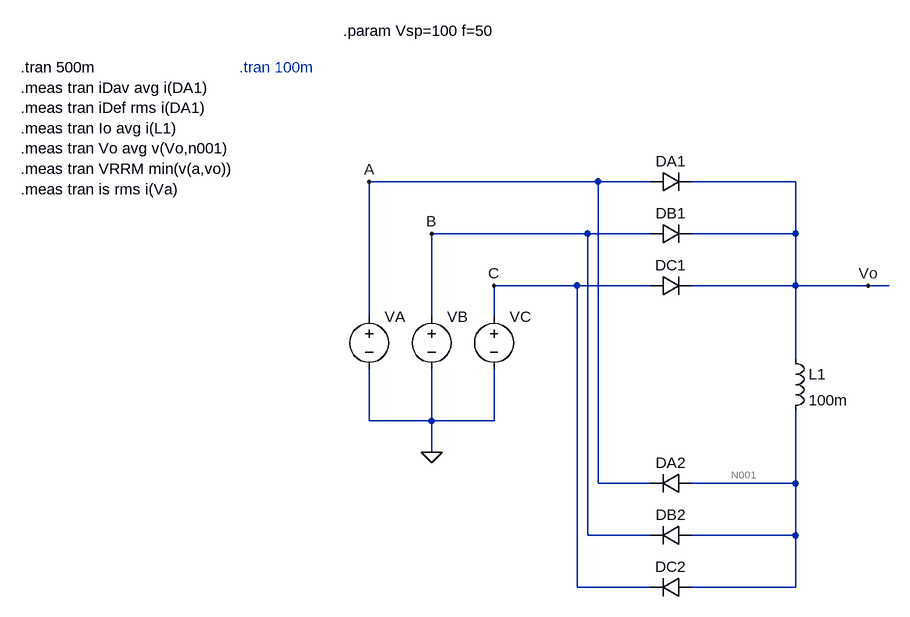
[diagram p0: schematic rectificPolif.asc]
rectificPolif.asc, the LTspice schematic file:
Version 4
SHEET 1 1716 984
WIRE 1072 224 720 224
WIRE 1152 224 1072 224
WIRE 1376 224 1216 224
WIRE 1056 304 816 304
WIRE 1152 304 1056 304
WIRE 1376 304 1376 224
WIRE 1376 304 1216 304
WIRE 1040 384 912 384
WIRE 1152 384 1040 384
WIRE 1376 384 1376 304
WIRE 1376 384 1216 384
WIRE 1488 384 1376 384
WIRE 1520 384 1488 384
WIRE 720 432 720 224
WIRE 816 432 816 304
WIRE 912 432 912 384
WIRE 1376 496 1376 384
WIRE 720 592 720 512
WIRE 816 592 816 512
WIRE 816 592 720 592
WIRE 912 592 912 512
WIRE 912 592 816 592
WIRE 816 640 816 592
WIRE 1072 688 1072 224
WIRE 1152 688 1072 688
WIRE 1376 688 1376 576
WIRE 1376 688 1216 688
WIRE 1056 768 1056 304
WIRE 1152 768 1056 768
WIRE 1376 768 1376 688
WIRE 1376 768 1216 768
WIRE 1040 848 1040 384
WIRE 1152 848 1040 848
WIRE 1376 848 1376 768
WIRE 1376 848 1216 848
FLAG 720 224 A
FLAG 816 304 B
FLAG 912 384 C
FLAG 1488 384 Vo
FLAG 816 640 0
SYMBOL diode 1152 240 R270
WINDOW 0 32 32 VTop 2
WINDOW 3 0 32 Invisible 2
SYMATTR InstName DA1
SYMBOL diode 1216 672 R90
WINDOW 0 0 32 VBottom 2
WINDOW 3 32 32 Invisible 2
SYMATTR InstName DA2
SYMBOL diode 1152 320 R270
WINDOW 0 32 32 VTop 2
WINDOW 3 0 32 Invisible 2
SYMATTR InstName DB1
SYMBOL diode 1152 400 R270
WINDOW 0 32 32 VTop 2
WINDOW 3 0 32 Invisible 2
SYMATTR InstName DC1
SYMBOL diode 1216 752 R90
WINDOW 0 0 32 VBottom 2
WINDOW 3 32 32 Invisible 2
SYMATTR InstName DB2
SYMBOL diode 1216 832 R90
WINDOW 0 0 32 VBottom 2
WINDOW 3 32 32 Invisible 2
SYMATTR InstName DC2
SYMBOL voltage 720 416 R0
WINDOW 3 24 96 Invisible 2
WINDOW 123 0 0 Left 0
WINDOW 39 0 0 Left 0
SYMATTR Value SINE(0 {Vsp} {f} 0 0 120)
SYMATTR InstName VA
SYMBOL voltage 912 416 R0
WINDOW 3 24 96 Invisible 2
WINDOW 123 0 0 Left 0
WINDOW 39 0 0 Left 0
SYMATTR Value SINE(0 {Vsp} {f} 0 0 -120)
SYMATTR InstName VC
SYMBOL voltage 816 416 R0
WINDOW 3 24 96 Invisible 2
WINDOW 123 0 0 Left 0
WINDOW 39 0 0 Left 0
SYMATTR Value SINE(0 {Vsp} {f} 0 0 0)
SYMATTR InstName VB
SYMBOL ind 1360 480 R0
SYMATTR InstName L1
SYMATTR Value 100m
SYMATTR SpiceLine Rser=1f
TEXT 680 -8 Left 2 !.param Vsp=100 f=50
TEXT 520 48 Left 2 ;.tran 100m
TEXT 184 48 Left 2 !.tran 500m\n.meas tran iDav avg i(DA1)\n.meas tran iDef rms i(DA1)\n.meas tran Io avg i(L1)\n.meas tran Vo avg v(Vo,n001)\n.meas tran VRRM min(v(a,vo))\n.meas tran is rms i(Va)

The netlist it stands for:
* rectificPolif.asc
DA1 A Vo D
DA2 N001 A D
DB1 B Vo D
DC1 C Vo D
DB2 N001 B D
DC2 N001 C D
VA A 0 SINE(0 {Vsp} {f} 0 0 120)
VC C 0 SINE(0 {Vsp} {f} 0 0 -120)
VB B 0 SINE(0 {Vsp} {f} 0 0 0)
L1 Vo N001 100m Rser=1f
.model D D
.lib standard.dio
.param Vsp=100 f=50
* .tran 100m
.tran 500m
.meas tran iDav avg i(DA1)
.meas tran iDef rms i(DA1)
.meas tran Io avg i(L1)
.meas tran Vo avg v(Vo,n001)
.meas tran VRRM min(v(a,vo))
.meas tran is rms i(Va)
.backanno
.end